# EAGLE design Traszka (EAGLE 9.6.2)
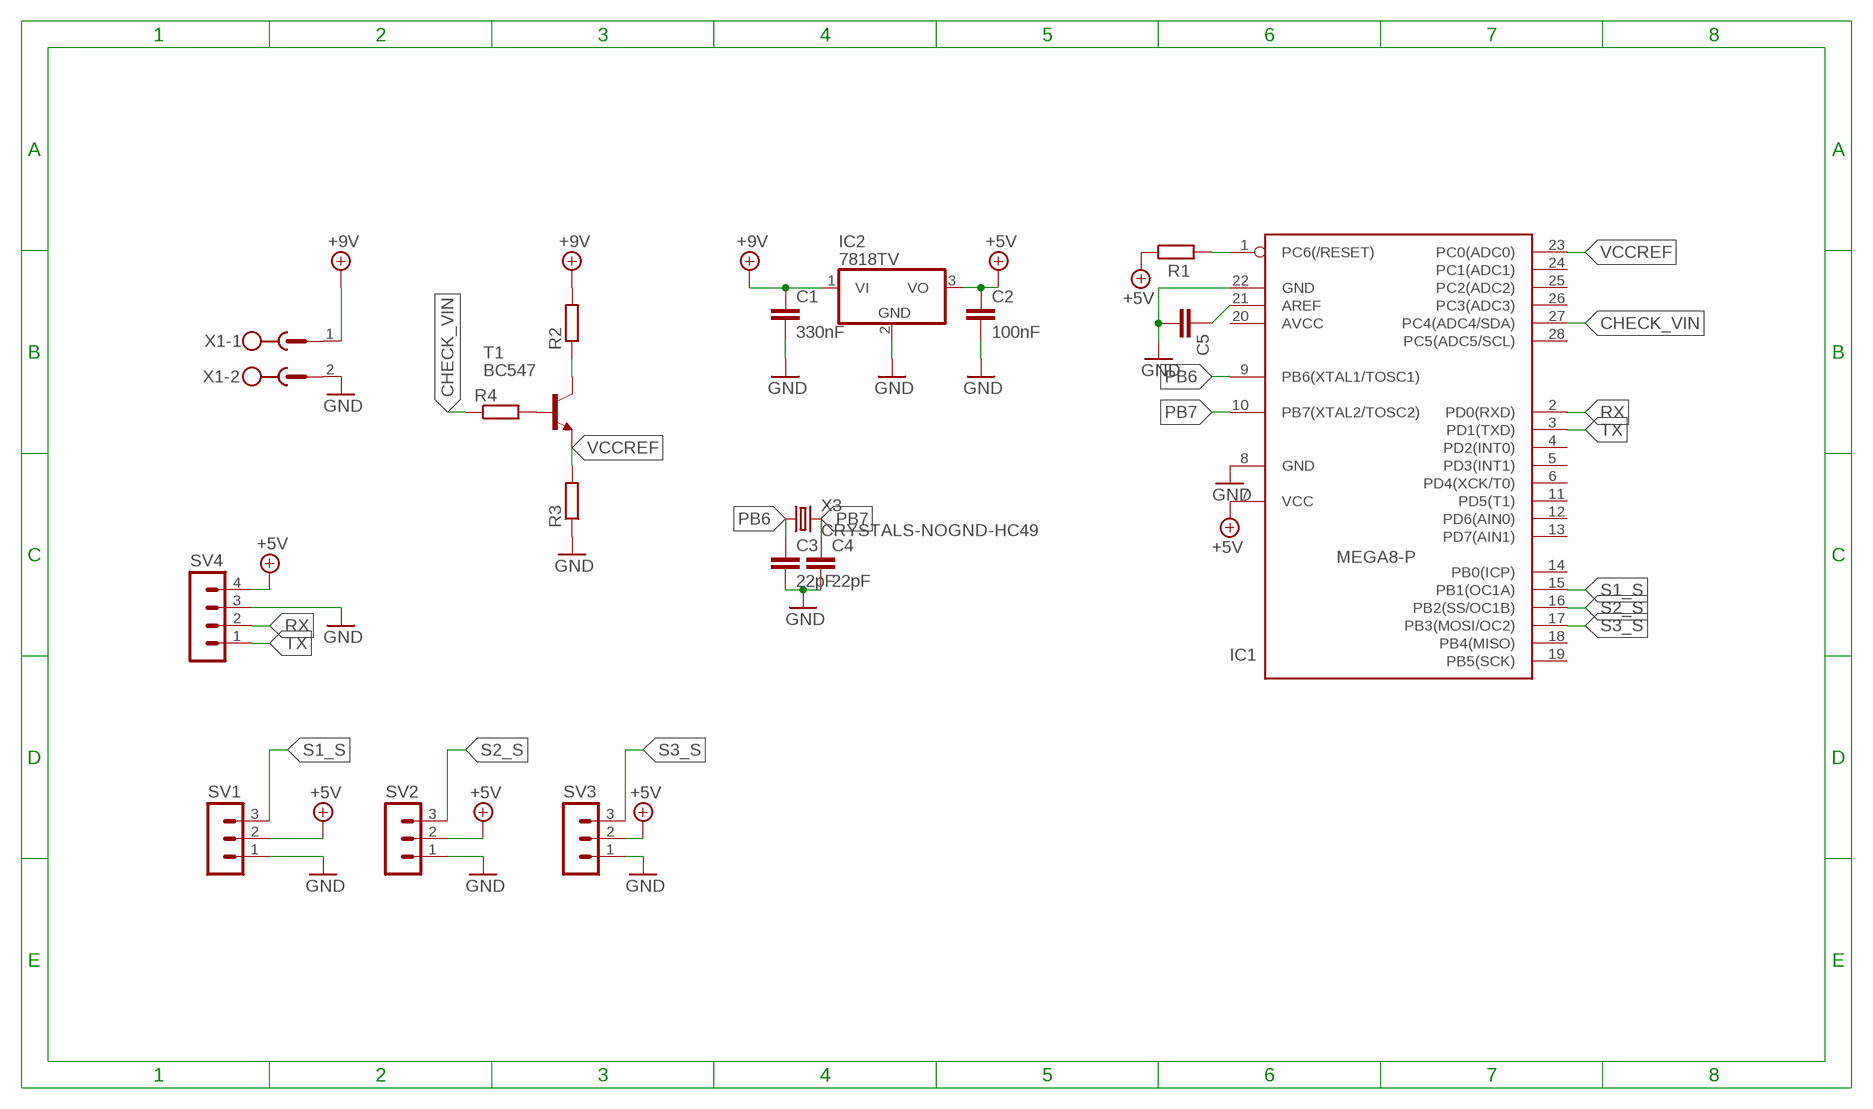
[diagram p0: schematic, sheet 1]

## Parts
C1  330nF  C-EU050-024X044  [C050-024X044]
C2  100nF  C-EU050-024X044  [C050-024X044]
C3  22pF  C-EU050-024X044  [C050-024X044]
C4  22pF  C-EU050-024X044  [C050-024X044]
C5  C-EU050-024X044  [C050-024X044]
IC1  MEGA8-P  [DIL28-3]
IC2  7818TV  [TO220V]
R1  R-EU_0204/7  [0204/7]
R2  R-EU_0204/7  [0204/7]
R3  R-EU_0204/5  [0204/5]
R4  R-EU_0204/7  [0204/7]
SV1  MA03-1  [MA03-1]
SV2  MA03-1  [MA03-1]
SV3  MA03-1  [MA03-1]
SV4  MA04-1  [MA04-1]
T1  BC547  [TO92]
X1  MSTBV2  [MSTBV2]
X3  CRYSTALS-NOGND-HC49  [HC49]

## Nets
+5V: C2.1 IC1.7(VCC) IC2.3(VO) R1.1 SV1.2 SV2.2 SV3.2 SV4.4
+9V: C1.1 IC2.1(VI) R2.2 X1.1
CHECK_VIN: IC1.27(PC4(ADC4/SDA)) R4.1
GND: C1.2 C2.2 C3.2 C4.2 C5.2 IC1.8(GND) IC1.22(GND) IC2.2(GND) R3.1 SV1.1 SV2.1 SV3.1 SV4.3 X1.2
N$1: IC1.1(PC6(/RESET)) R1.2
N$2: C5.1 IC1.21(AREF)
N$3: R2.1 T1.3(C)
N$4: R4.2 T1.2(B)
PB6: C3.1 IC1.9(PB6(XTAL1/TOSC1)) X3.1
PB7: C4.1 IC1.10(PB7(XTAL2/TOSC2)) X3.2
RX: IC1.2(PD0(RXD)) SV4.2
S1_S: IC1.15(PB1(OC1A)) SV1.3
S2_S: IC1.16(PB2(SS/OC1B)) SV2.3
S3_S: IC1.17(PB3(MOSI/OC2)) SV3.3
TX: IC1.3(PD1(TXD)) SV4.1
VCCREF: IC1.23(PC0(ADC0)) R3.2 T1.1(E)
Unconnected: IC1.4(PD2(INT0)) IC1.5(PD3(INT1)) IC1.6(PD4(XCK/T0)) IC1.11(PD5(T1)) IC1.12(PD6(AIN0)) IC1.13(PD7(AIN1)) IC1.14(PB0(ICP)) IC1.18(PB4(MISO)) IC1.19(PB5(SCK)) IC1.24(PC1(ADC1)) IC1.25(PC2(ADC2)) IC1.26(PC3(ADC3)) IC1.28(PC5(ADC5/SCL))

## Power pins joined to a net without a drawn wire
AVCC: IC1.20(AVCC)

## Library data of the parts
C1-C5 = rcl:C-EU: CAPACITOR, European symbol; SPICEPREFIX: C
IC1 = atmel:MEGA8-P: MICROCONTROLLER 8 Kbytes FLASH, 1 kbytes SRAM, 512 bytes EEPROM, USART, 4-channel 10 bit ADC, 2-channel 8 bit ADC Pin compatible with Atmega48, ATMega88, ATMega168 Source: avr.lbr; OC_FARNELL: unknown; OC_NEWARK: unknown
IC2 = linear:78*: Positive VOLTAGE REGULATOR Source: http://cache.national.com/ds/LM/LM78L05.pdf http://www.fairchildsemi.com/ds/LM/LM7805.pdf
R1-R4 = rcl:R-EU_: RESISTOR, European symbol; SPICEPREFIX: R
SV1-SV3 = con-lstb:MA03-1: PIN HEADER; OC_FARNELL: unknown; OC_NEWARK: unknown
SV4 = con-lstb:MA04-1: PIN HEADER; OC_FARNELL: unknown; OC_NEWARK: unknown
T1 = transistor:BC547: NPN TRANSISTOR
X1 = con-phoenix-500:MSTBV2: PHOENIX; OC_FARNELL: unknown; OC_NEWARK: unknown
X3 = IQD-Frequency-Products:CRYSTALS-NOGND: CRYSTALS CAN NOT GROUNDED

## Board
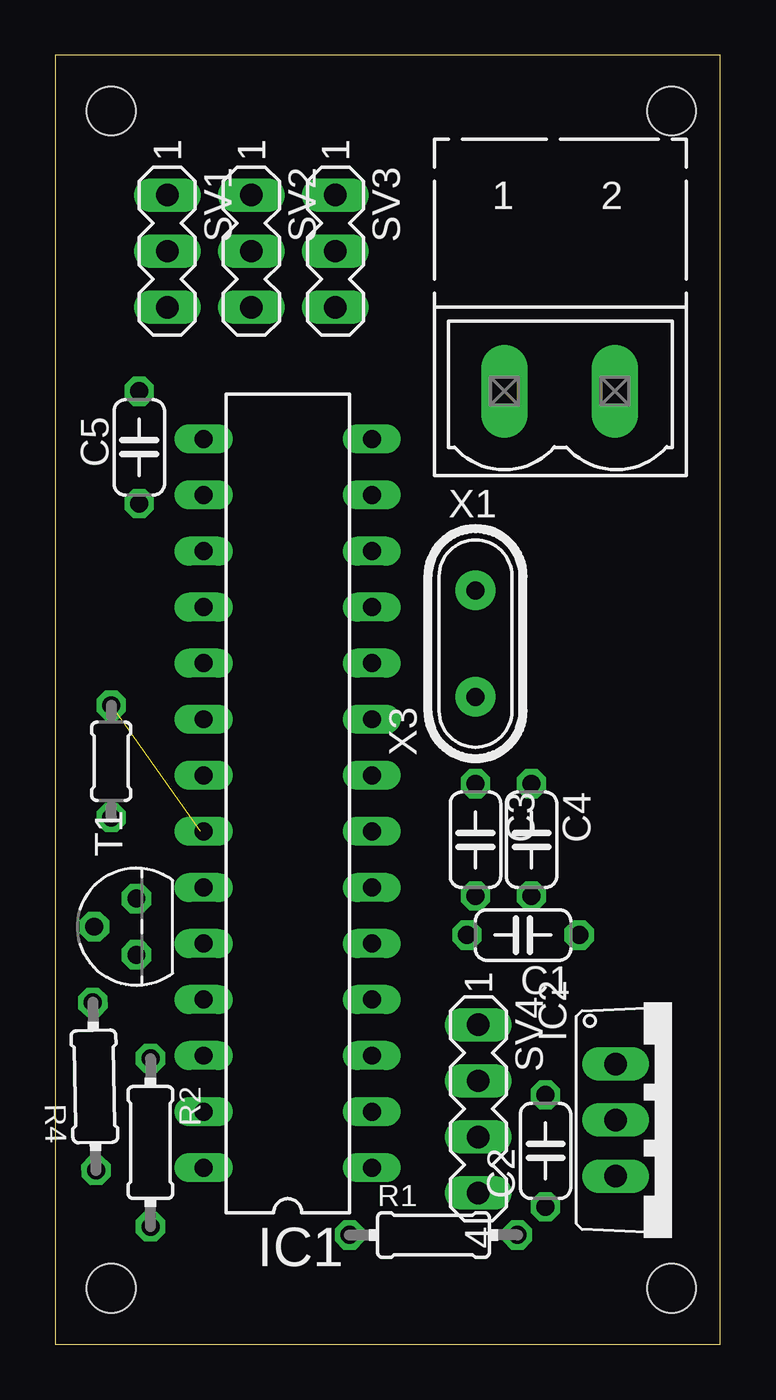
[diagram p1: board, top side]
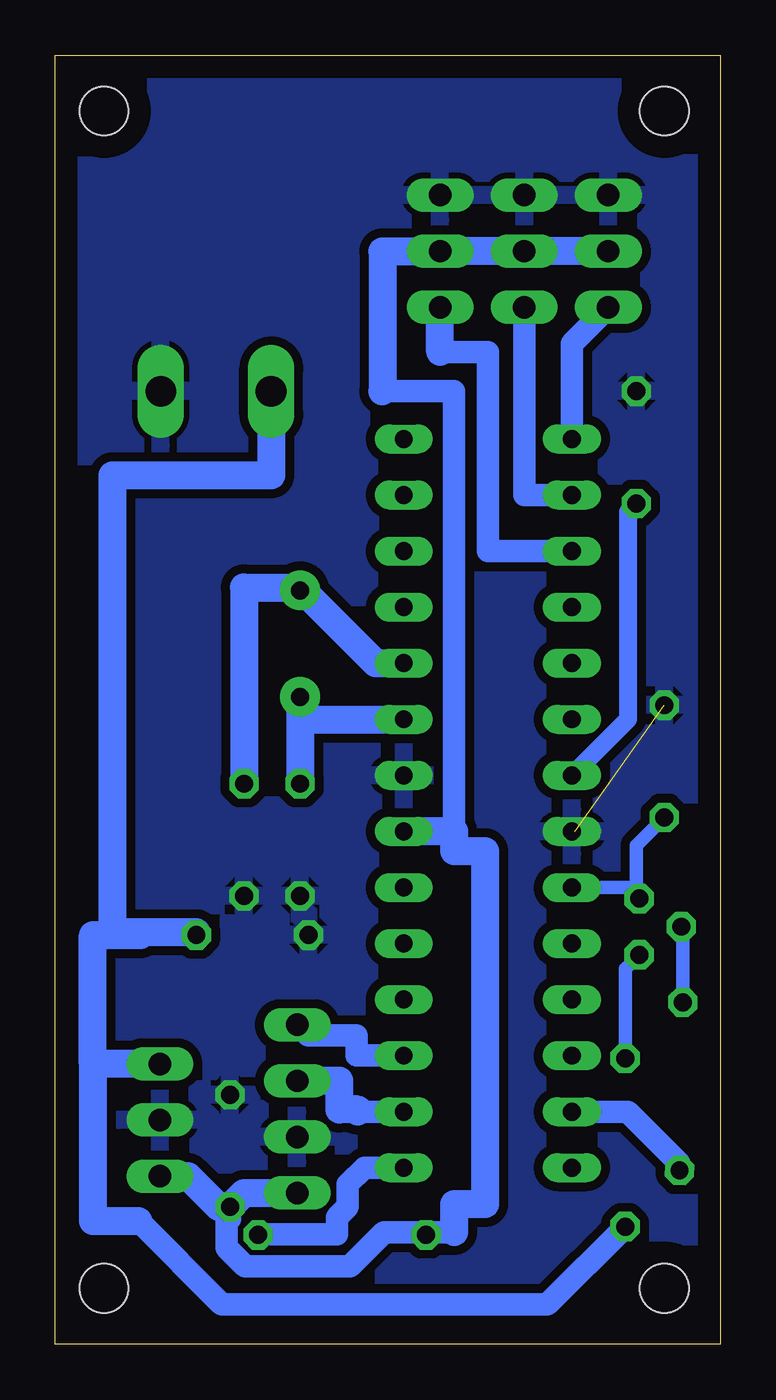
[diagram p2: board, bottom side, seen from below]

Size 30.15 x 58.41 mm. Coordinates in mm from the lower left corner, seen from the top.
Outline: 0,0 30.15,0 30.15,58.41 0,58.41 0,0
Copper layers (1*16): Top 0.035mm / dielectric 1.5mm / Bottom 0.035mm
Design rules "default *": minimum track width 6mil, minimum drill 0.35mm, track to track 6mil, track to pad 10mil, pad to pad 6mil, via to via 6mil, smd to smd 6mil, copper to edge 40mil, drill to drill 6mil, minimum pad ring 10mil, minimum via ring 8mil, stop-mask expansion 4mil, vias tented up to drill 0mil, thermal gap 10mil
Holes 2.2 mm at 2.54,2.54 2.54,55.88 27.94,55.88 27.94,2.54

### Footprints (pad centres in the part's own frame; a part is rotated, then mirrored left to right if it is on the bottom)
C050-024X044 = drill 0.813 octagon: 1 -2.54,0; 2 2.54,0
DIL28-3 = drill 0.813 long: 1 -16.51,-3.81; 2 -13.97,-3.81; 3 -11.43,-3.81; 4 -8.89,-3.81; 5 -6.35,-3.81; 6 -3.81,-3.81; 7 -1.27,-3.81; 8 1.27,-3.81; 9 3.81,-3.81; 10 6.35,-3.81; 11 8.89,-3.81; 12 11.43,-3.81; 13 13.97,-3.81; 14 16.51,-3.81; 15 16.51,3.81; 16 13.97,3.81; 17 11.43,3.81; 18 8.89,3.81; 19 6.35,3.81; 20 3.81,3.81; 21 1.27,3.81; 22 -1.27,3.81; 23 -3.81,3.81; 24 -6.35,3.81; 25 -8.89,3.81; 26 -11.43,3.81; 27 -13.97,3.81; 28 -16.51,3.81
TO220V = drill 1.016 long: 1 -2.54,-2.54; 2 0,-2.54; 3 2.54,-2.54
0204/7 = drill 0.813 octagon: 1 -3.81,0; 2 3.81,0
0204/5 = drill 0.813 octagon: 1 -2.54,0; 2 2.54,0
MA03-1 = drill 1.016 long: 1 -2.54,0; 2 0,0; 3 2.54,0
MA04-1 = drill 1.016 long: 1 -3.81,0; 2 -1.27,0; 3 1.27,0; 4 3.81,0
TO92 = drill 0.813 octagon: 1 1.27,0; 2 0,1.905; 3 -1.27,0
MSTBV2 = drill 1.397 long: 1 -2.5,0; 2 2.5,0
HC49 = drill 0.813 pad 1.8: 1 -2.413,0; 2 2.413,0

### Placement (x,y rotation side)
C1  21.21,18.54 180 top
C2  22.23,8.76 90 top
C3  19.05,22.86 270 top
C4  21.59,22.86 270 top
C5  3.81,40.64 90 top
IC1  10.54,24.51 90 top
IC2  27.94,10.16 270 top
R1  17.14,4.95 0 top
R2  4.32,9.14 270 top
R3  2.54,26.42 270 top
R4  1.78,11.68 91.1 top
SV1  5.08,49.53 270 top
SV2  8.89,49.53 270 top
SV3  12.7,49.53 270 top
SV4  19.18,10.67 270 top
T1  3.68,18.92 90 top
X1  22.86,43.18 0 top
X3  19.05,31.75 90 top

### Tracks (layer width: path | path; a pad name or v marks a point on that pad's centre or on a via)
+5V
  Bottom 1.016: 15.32,43.18 12.06,43.18 12.06,23.24 | 12.06,5.08 13.21,5.08 | 13.21,5.08 R1.1 | C2.1 22.23,5.7 22.38,5.54 22.38,4.36 21.54,3.53 16.79,3.53 15.24,5.08 13.21,5.08
  Bottom 1.27: SV1.2 SV2.2 SV3.2 15.32,49.53 15.32,43.18 | IC2.3 24.13,7.62 22.73,6.22 C2.1 21.59,6.86 SV4.4 | IC1.7 12.06,23.24 12.06,22.35 10.67,22.35 10.67,6.35 12.06,6.35 12.06,5.08
+9V
  Bottom 1.016: 26.38,5.59 22.61,1.82 7.83,1.82 R2.2
  Bottom 1.27: IC2.1 28.45,12.7 | 28.45,12.7 28.45,5.59 26.38,5.59 | 28.45,12.7 28.45,18.54 26.29,18.54 26.29,18.67 | C1.1 23.75,18.67 26.29,18.67 | 26.29,18.67 27.56,18.67 27.56,39.37 20.36,39.37 X1.1
CHECK_VIN
  Bottom 1.016: IC1.27 4.19,10.54 1.85,8.2 R4.1
GND  (1 unrouted)
  Bottom 1.016: IC1.22 6.6,23.24
  pour Bottom (isolate 0.406): -1.27,58.42 -1.27,0 30.48,0 30.48,58.42
N$1
  Bottom 1.016: R1.2 20.6,4.95 20.57,4.98 17.37,4.98 17.37,5.74 16.89,6.23 16.89,7.24 16.13,8 IC1.1
N$2
  Bottom 0.813: IC1.21 4.19,28.32 4.19,37.72 C5.1
N$3
  Bottom 0.61: T1.3 4.32,17.02 R2.1
N$4
  Bottom 0.61: R4.2 1.71,18.85 T1.2
PB6
  Bottom 1.27: 19.05,28.32 IC1.9 | X3.1 19.05,28.32 | 19.05,28.32 C3.1
PB7
  Bottom 1.27: IC1.10 15.62,30.86 18.92,34.16 X3.2 19.05,34.29 21.59,34.29 C4.1
RX
  Bottom 1.016: IC1.2 16.43,10.54
  Bottom 1.27: 16.43,10.54 16.43,10.64 17.27,10.64 17.27,11.94 SV4.2
S1_S
  Bottom 1.016: SV1.3 6.73,45.34 IC1.15
S2_S
  Bottom 1.016: SV2.3 8.89,38.48 IC1.16
S3_S
  Bottom 1.016: IC1.17 10.54,35.94 10.54,44.96 12.7,44.96
  Bottom 1.27: 12.7,44.96 SV3.3
TX
  Bottom 1.016: SV4.1 18.69,13.99 16.48,13.99 16.48,13.08 IC1.3
VCCREF
  Bottom 0.61: T1.1 3.81,20.32 | 3.81,20.32 4.19,20.7 IC1.23 | R3.2 3.81,22.61 3.81,20.32